# Altium schematic sheet ramp_generator.SchDoc
size A; SheetNumber: 1; SheetTotal: 1
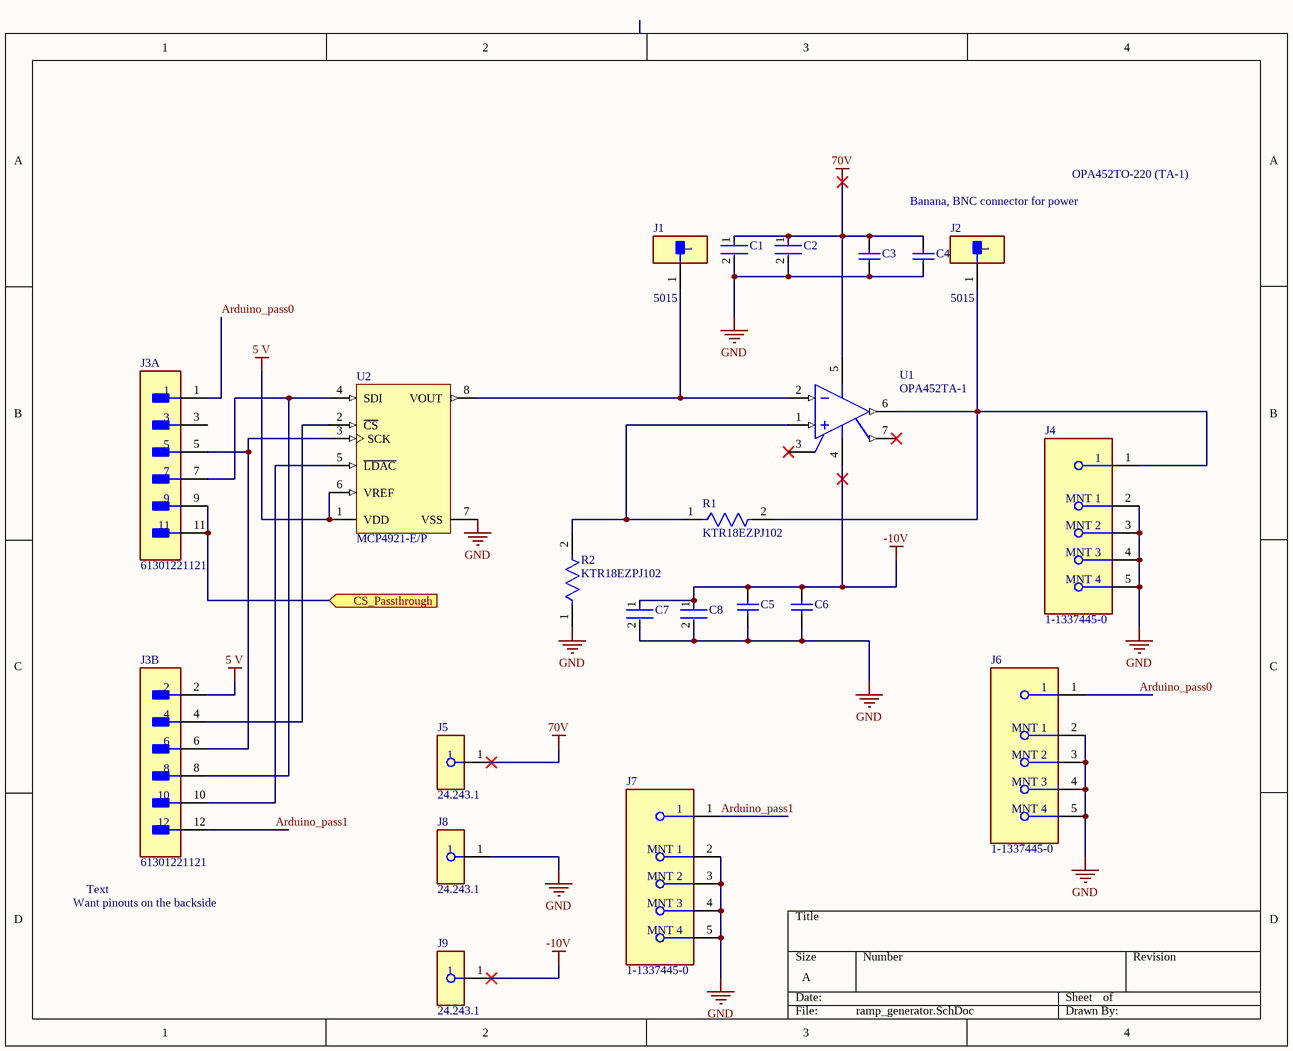
[diagram p0: ramp_generator.SchDoc]

## Parts
C1  C3216JB1A106M160AA  [FP-C3216-160-0_2-IPC_C]  (value not drawn)
C2  C3216JB1A106M160AA  [FP-C3216-160-0_2-IPC_C]  (value not drawn)
C3  CAP 100pF 100V 1206(3216)  [CAPC1206(3216)100_N]  (value not drawn)
C4  CAP 100pF 100V 1206(3216)  [CAPC1206(3216)100_N]  (value not drawn)
C5  CAP 100pF 100V 1206(3216)  [CAPC1206(3216)100_N]  (value not drawn)
C6  CAP 100pF 100V 1206(3216)  [CAPC1206(3216)100_N]  (value not drawn)
C7  C3216JB1A106M160AA  [FP-C3216-160-0_2-IPC_C]  (value not drawn)
C8  C3216JB1A106M160AA  [FP-C3216-160-0_2-IPC_C]  (value not drawn)
J1  5015  [FP-5015-MFG]
J2  5015  [FP-5015-MFG]
J3  61301221121  [FP-61301221121-MFG]  (parts A,B of 2)
J4  1-1337445-0  [FP-1-1337445-0-MFG]
J5  24.243.1  [FP-24_243_1-MFG]
J6  1-1337445-0  [FP-1-1337445-0-MFG]
J7  1-1337445-0  [FP-1-1337445-0-MFG]
J8  24.243.1  [FP-24_243_1-MFG]
J9  24.243.1  [FP-24_243_1-MFG]
R1  KTR18EZPJ102  [FP-KTR18-IPC_A]
R2  KTR18EZPJ102  [FP-KTR18-IPC_A]
U1  OPA452TA-1  [KVT0007A]
U2  MCP4921-E/P  [PDIP300-P8]

## Ports
CS_Passthrough (in)

## Nets
5 V: J3.2 U2.1(VDD) U2.6(VREF)
70V: C1.1 C2.1 C3.2 C4.2 J5.1 U1.5(V+)
-10V: C5.2 C6.1 C7.1 C8.1 J9.1 U1.4(V-)
GND: C1.2 C2.2 C3.1 C4.1 C5.1 C6.2 C7.2 C8.2 J4.2(MNT_1) J4.3(MNT_2) J4.4(MNT_3) J4.5(MNT_4) J6.2(MNT_1) J6.3(MNT_2) J6.4(MNT_3) J6.5(MNT_4) J7.2(MNT_1) J7.3(MNT_2) J7.4(MNT_3) J7.5(MNT_4) J8.1 R2.1 U2.7(VSS)
Arduino_pass0: J3.1 J6.1
Arduino_pass1: J3.12 J7.1
CS_Passthrough: J3.9 J3.11 ; port CS_Passthrough
NetJ1_1: J1.1 U1.2(VIN-) U2.8(VOUT)
NetJ2_1: J2.1 J4.1 R1.2 U1.6(VO)
NetJ3_4: J3.4 U2.2(~{CS})
NetJ3_5: J3.5 J3.6 U2.3(SCK)
NetJ3_7: J3.7 J3.8 U2.4(SDI)
NetJ3_10: J3.10 U2.5(~{LDAC})
NetR1_1: R1.1 R2.2 U1.1(VIN+)

Not connected (* = marked no-connect by the designer): J3 3; U1 3(NC)* 7(FLAG)*

## Notes on the sheet
- OPA452TO-220 (TA-1)
- Banana, BNC connector for power
- Want pinouts on the backside
- Text

## Library data of the parts
C1 C2 C7 C8 = CMP-08246-004766-1: Multilayer Ceramic Capacitors 10uF ±20% 10V JB SMD 1206; Min Operating Temperature: -25°C; Mount: Surface Mount; Max Operating Temperature: 85°C; Capacitance: 10uF; Thickness: 0.069inch; Voltage Rating: 10V; Case/Package: 1206; Dielectric Material: Ceramic; Case Code (Metric): 3216; Width: 0.063inch; RoHS Compliant: Yes; Package Quantity: 2000; Voltage Rating (DC): 10V; Lead Free: Lead Free; Packaging: Cut Tape; Length: 0.126inch; Case Code (Imperial): 1206; Series: C; Tolerance: 20%
C3-C6 = CMP-1037-01579-1: CAP 100pF 100V ±1% 1206 (3216 Metric) Thickness 1mm SMD; Case-Metric: 3216; Tolerance: Â±1%; Case-EIA: 1206; Max Thickness: 1 mm; Rated Voltage: 100 V; Technology: SMT; Value: 100pF
J1 J2 = CMP-2000-05183-2: PC TEST POINT MINIATURE; Manufacturer: keystone; Number Of Contacts: 1; Conn Orientation: Straight; Category: Conn; Manufacturer Part Number: 5015; Digikey Description: PC TEST POINT MINIATURE; Automotive: No; Lead Free: Yes; Octopart: https://octopart.com/5015-keystone-3822; ComponentLink2URL: http://www.keyelco.com/product-pdf.cfm?p=1353; Package: 5015; RoHS: TRUE; Device Class L3: unset; Device Class L2: unset; Contact Material: Silver; Device Class L1: Connectors; Height: 1.65mm; ComponentLink2Description: Datasheet
J3 = CMP-1502-01088-2: CONN HEADER VERT 12POS 2.54MM; Number of Contacts: 12; Row Spacing: 0.1inch; Voltage Rating: 250V; Gender: Male; Mount: Through Hole; Flammability Rating: UL94 V-0; Termination: Solder; Fastening Type: Pull; Max Operating Temperature: 105°C; Contact Mating Length: 0.236inch; Contact Material: Copper Alloy; Color: Black; Insulation Color: Black; Connector Type: Header; Contact Shape: Square; Contact Type: Male Pin; Contact Plating: Gold; Min Operating Temperature: -40°C; Insulation Material: Nylon; Series: WR-PHD; RoHS Compliant: Yes; Number of Positions: 12; Packaging: Bulk; Contact Finish - Mating: GOLD; Number of Rows: 2; Pitch: 0.1inch
J4 J6 J7 = CMP-03357-000006-1: CONN BNC JACK STR 50 OHM PCB; PCB Mount Retention: With; Operating Frequency: 0 to 4Hz; PCB Mounting Orientation: Vertical; PCB Thickness: 0.126inch; Body Plating: Silver; Frequency: 4GHz; Impedance: 50R; Insulation Resistance: 5GR; Body Material: Brass; Dielectric Material: PTFE; Gender: Female; Sealable: No (Without); Number of Positions: 1; Orientation: Straight; RoHS Compliant: Yes; Min Operating Temperature: -65°C; Packaging: Bag; Fastening Type: Bayonet; Radiation Hardening: No; Max Frequency: 4GHz; Material: Brass; Contact Plating: Silver; ELV: Compliant; Depth: 12mm; Series: BNC; Package Quantity: 50; Connector Type: BNC; Contact Material: Brass; Max Operating Temperature: 165°C; Length: 12mm; Termination: Solder; Mount: Through Hole; Insulation Material: Polytetrafluoroethylene
J5 J8 J9 = CMP-12400-000001-2: Banana Test Connector, 4mm, Socket, PCB Mount, 24 A, 60 VDC, Silver Plated Contacts, Green; Gender: Male; Voltage Rating: 30V; Current Rating: 20A; REACH SVHC: No SVHC; Contact Material: Brass; RoHS Compliant: Yes; Contact Plating: Silver; Voltage Rating (DC): 30V; Length: 24mm; Termination: Solder
R1 R2 = CMP-08839-031408-1: Res Thick Film 1206 1kΩ 5% 0.1W ±200ppm/°C Automotive Paper T/R; Power Rating: 250mW; Resistance: 1kR; Mount: Surface Mount; Length: 0.126inch; Tolerance: 5%; Temperature Coefficient: 200ppm/°C; Width: 0.063inch; RoHS Compliant: Yes; Max Operating Temperature: 155°C; Max Power Dissipation: 250mW; Resistor Type: Thick Film; Number of Terminations: 2; Packaging: Tape and Reel; Case Code (Metric): 3216; Case/Package: 1206; Lead Free: Lead Free; Size Code: 1206; Features: Automotive AEC-Q200; Case Code (Imperial): 1206; Package Quantity: 1; Height: 0.026inch; Series: KTR; Min Operating Temperature: -55°C
U1 = CMP-0272-03697-4: Operational Amplifier, 20 to 80 V, -40 to 125 degC, 7-pin FM (KVT7), Green (RoHS & no Sb/Br); Manufacturer: Texas Instruments; Slew Rate(Typ)(V/us): 10; IIB(Max)(pA): 100; Offset Drift(Typ)(uV/C): 5; Number of Channels: 1; CMRR(Min)(dB): 86; Sub Family: High Output Current Amplifier (>=50mA), High Supply Voltage Amplifier (>=30V), Precision Amplifier; Total Supply Voltage(Min)(+5V is 5, +/-5V is 10): 20; Total Supply Voltage(Max)(+5V is 5, +/-5V is 10): 80; Vio (25C)(Max)(mV): 3; GBW(Typ)(MHz): 1.8; Iq per channel(Max)(mA): 6.5; Rating: Catalog; Packing: TUBE; PackageDescription: 7-Pin Plastic Flange Mount, Body 10.16 x 4.495 mm, Pitch 1.27 mm; PartNumber: OPA452TA-1; ComponentLink2Description: Datasheet; Mounting Technology: Through Hole; Eco-Plan: Green (RoHS & no Sb/Br); ComponentLink3URL: http://www.ti.com/litv/pdf/mpzf004; ComponentLink1Description: Manufacturer URL; DatasheetVersion: SBOS127C; PackageReference: KVT0007A; ComponentLink2URL: http://www.ti.com/lit/ds/symlink/opa452.pdf; ComponentLink1URL: http://www.ti.com/; PackageVersion: 4204912/A, 01/2003; ComponentLink3Description: Package Specification; RevisionNote: Footprint corrected
U2 = CMP-0188-00217-2: 12-Bit DAC with SPI Interface, 8-Pin PDIP, Extended Temperature; ComponentLink1Description: Manufacturer URL; ComponentLink2URL: http://ww1.microchip.com/downloads/en/DeviceDoc/22248a.pdf; ComponentLink3Description: Package Specification; PackageVersion: revBB, Aug-2009; PackageReference: PDIP300-P8; ComponentLink1URL: http://www.microchip.com/; PackageDescription: 8-Lead Plastic Dual In-Line (P) - 300 mil Body [PDIP]; Code_JEDEC: MS-001; DatasheetVersion: revA, Apr-2010; ComponentLink2Description: Datasheet; ComponentLink3URL: http://www.microchip.com/stellent/groups/techpub_sg/documents/packagingspec/en012702.pdf; RevisionNote: URLs added. DatasheetVersion updated. Sch updated.